# Altium schematic sheet mcu-adc.SchDoc
size A3; DocumentNumber: 23; SheetNumber: 23; SheetTotal: 45; SheetDescription: MCU ADC
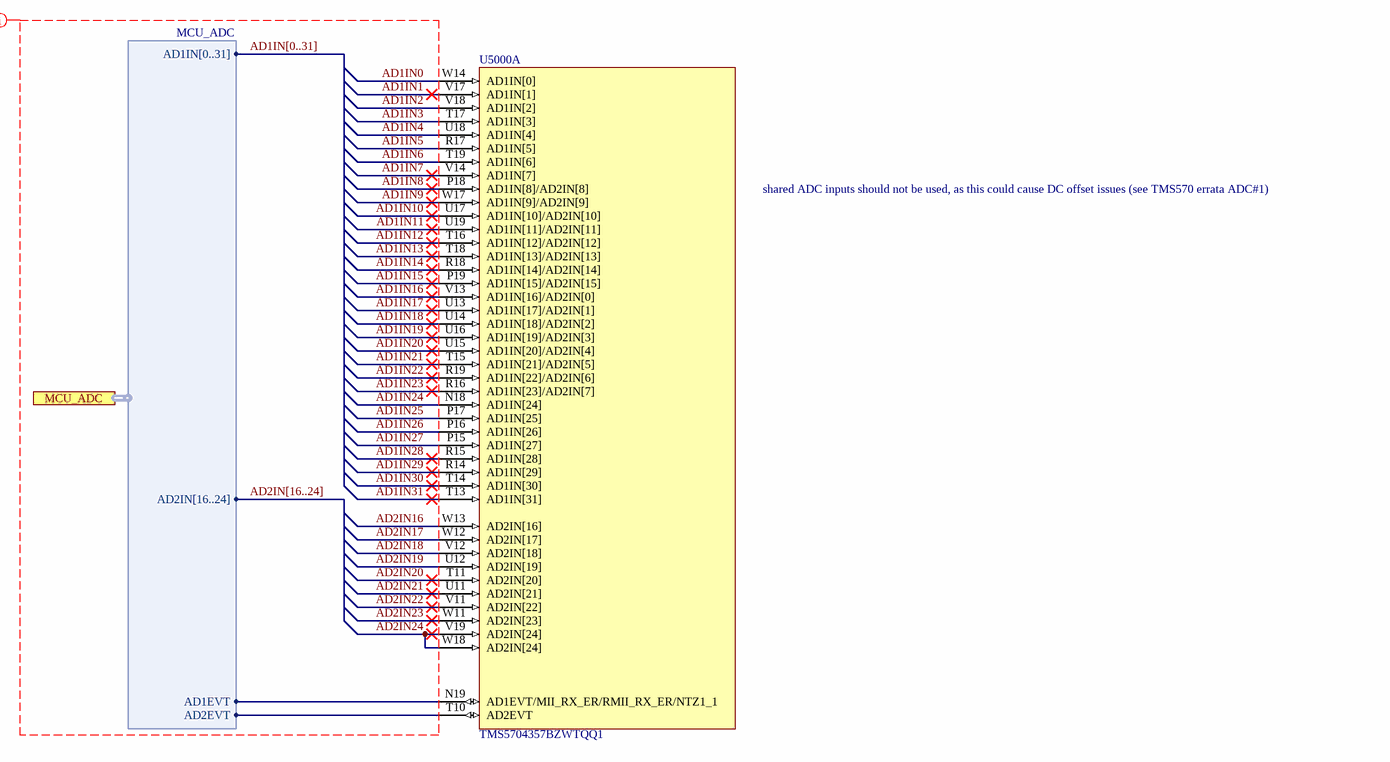
[diagram p0: mcu-adc.SchDoc]

## Parts
U5000  TMS5704357BZWTQQ1  [BGA337C80P19X19_1600X1600X140]  (part A of 6)

## Ports
MCU_ADC (harness MCU_ADC)

## Harnesses
MCU_ADC: AD2IN[16..24], AD1EVT, AD2EVT, AD1IN[0..31]

## Nets
AD1IN0: U5000.W14(AD1IN[0])
AD1IN1: U5000.V17(AD1IN[1])
AD1IN2: U5000.V18(AD1IN[2])
AD1IN3: U5000.T17(AD1IN[3])
AD1IN4: U5000.U18(AD1IN[4])
AD1IN5: U5000.R17(AD1IN[5])
AD1IN6: U5000.T19(AD1IN[6])
AD1IN7: U5000.V14(AD1IN[7])
AD1IN8: U5000.P18(AD1IN[8]/AD2IN[8])
AD1IN9: U5000.W17(AD1IN[9]/AD2IN[9])
AD1IN10: U5000.U17(AD1IN[10]/AD2IN[10])
AD1IN11: U5000.U19(AD1IN[11]/AD2IN[11])
AD1IN12: U5000.T16(AD1IN[12]/AD2IN[12])
AD1IN13: U5000.T18(AD1IN[13]/AD2IN[13])
AD1IN14: U5000.R18(AD1IN[14]/AD2IN[14])
AD1IN15: U5000.P19(AD1IN[15]/AD2IN[15])
AD1IN16: U5000.V13(AD1IN[16]/AD2IN[0])
AD1IN17: U5000.U13(AD1IN[17]/AD2IN[1])
AD1IN18: U5000.U14(AD1IN[18]/AD2IN[2])
AD1IN19: U5000.U16(AD1IN[19]/AD2IN[3])
AD1IN20: U5000.U15(AD1IN[20]/AD2IN[4])
AD1IN21: U5000.T15(AD1IN[21]/AD2IN[5])
AD1IN22: U5000.R19(AD1IN[22]/AD2IN[6])
AD1IN23: U5000.R16(AD1IN[23]/AD2IN[7])
AD1IN24: U5000.N18(AD1IN[24])
AD1IN25: U5000.P17(AD1IN[25])
AD1IN26: U5000.P16(AD1IN[26])
AD1IN27: U5000.P15(AD1IN[27])
AD1IN28: U5000.R15(AD1IN[28])
AD1IN29: U5000.R14(AD1IN[29])
AD1IN30: U5000.T14(AD1IN[30])
AD1IN31: U5000.T13(AD1IN[31])
AD2IN16: U5000.W13(AD2IN[16])
AD2IN17: U5000.W12(AD2IN[17])
AD2IN18: U5000.V12(AD2IN[18])
AD2IN19: U5000.U12(AD2IN[19])
AD2IN20: U5000.T11(AD2IN[20])
AD2IN21: U5000.U11(AD2IN[21])
AD2IN22: U5000.V11(AD2IN[22])
AD2IN23: U5000.W11(AD2IN[23])
AD2IN24: U5000.V19(AD2IN[24]) U5000.W18(AD2IN[24])
NetU5000_N19: U5000.N19(AD1EVT/MII_RX_ER/RMII_RX_ER/NTZ1_1) ; port MCU_ADC.AD1EVT
NetU5000_T10: U5000.T10(AD2EVT) ; port MCU_ADC.AD2EVT

## Buses and harness runs
bus AD1IN[0..31]
bus AD2IN[16..24]

## Layout directives
net class MCU_ADC: AD1IN0, AD1IN1, AD1IN2, AD1IN3, AD1IN4, AD1IN5, AD1IN6, AD1IN7, AD1IN8, AD1IN9, AD1IN10, AD1IN11, AD1IN12, AD1IN13, AD1IN14, AD1IN15, AD1IN16, AD1IN17, AD1IN18, AD1IN19, AD1IN20, AD1IN21, AD1IN22, AD1IN23, AD1IN24, AD1IN25, AD1IN26, AD1IN27, AD1IN28, AD1IN29, AD1IN30, AD1IN31, AD1IN[0..31], AD2IN16, AD2IN17, AD2IN18, AD2IN19, AD2IN20, AD2IN21, AD2IN22, AD2IN23, AD2IN24, AD2IN[16..24]

## Notes on the sheet
- shared ADC inputs should not be used, as this could cause DC offset issues (see TMS570 errata ADC#1)
- Fraunhofer IISB
- Schottkystr. 10
- developed by:
- 91058 Erlangen
- Germany
- Author
- Project
- License
- Description
- File
- Version
- Release Date
- Sheet
- foxbms.org <https://foxbms.org>
- www.iisb.fraunhofer.de <https://www.iisb.fraunhofer.de/>
- foxBMS Team
- /